# Altium schematic sheet Voltage regulator.SchDoc
size A4
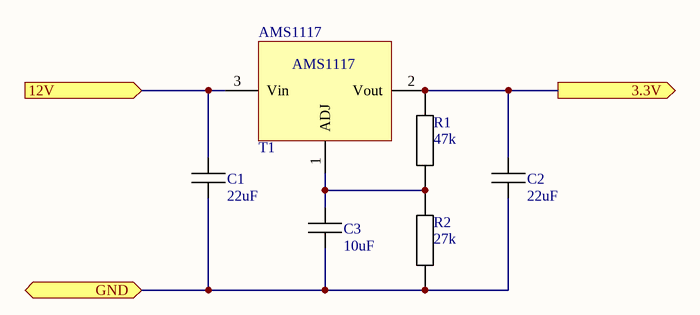
[diagram p0: Voltage regulator.SchDoc]

## Parts
AMS1117  T1
C1  22uF  [0805-C]
C2  22uF  [0805-C]
C3  10uF  [0805-C]
R1  47k  [0805-R]
R2  27k  [0805-R]

## Ports
3.3V (out), 12V (in), GND (bidir)

## Nets
3.3V: AMS1117.2(Vout) C2.2 R1.2 ; port 3.3V
12V: AMS1117.3(Vin) C1.2 ; port 12V
GND: C1.1 C2.1 C3.1 R2.1 ; port GND
NetAMS1117_1: AMS1117.1(ADJ) C3.2 R1.1 R2.2

## Library data of the parts
AMS1117 = AMS1117
C1-C3 = Capacitor
R1 R2 = Resistor